# Altium schematic sheet Sensors.SchDoc: {Наименование}
size 209 x 297 mm; DocumentNumber: {Обозначение}; SheetNumber: {}; SheetTotal: {}; PageSetup: Record=PageOptions|CenterHorizontal=False|CenterVertical=False|PrintScale=0.99|XCorrection=0.00|YCorrection=0.00|PrintKind=2|BorderSize=5000000|LeftOffset=0|BottomOffset=0|Orientation=1|PaperLength=1000|PaperWidth=1000|Scale=100|PaperSource=15|PrintQuality=-3|MediaType=1|DitherType=10|PrintScaleMode=1|PaperKind=A4|PaperIndex=9; Rule: PcbType=ProtelPcb
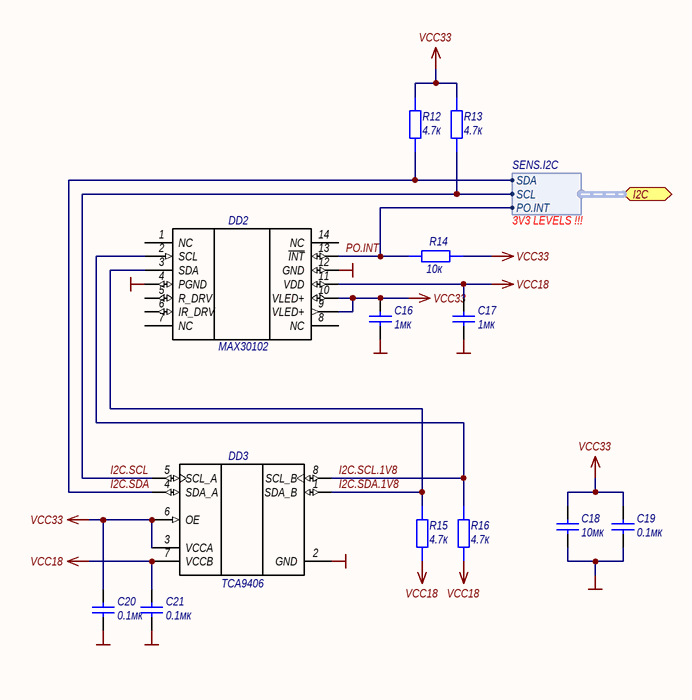
[diagram p0: Sensors.SchDoc]

## Parts
C16  value 1мк  [CAPC1005L]  (hidden comment: CL05A105KQ5NNN)
C17  value 1мк  [CAPC1005L]  (hidden comment: CL05A105KQ5NNN)
C18  value 10мк  [CAPC1005L]  (hidden comment: CL05A106MQ5NUN)
C19  value 0.1мк  [CAPC1005L]  (hidden comment: CL05A104KP5NNN)
C20  value 0.1мк  [CAPC1005L]  (hidden comment: CL05A104KP5NNN)
C21  value 0.1мк  [CAPC1005L]  (hidden comment: CL05A104KP5NNN)
DD2  MAX30102  [MAX30102]
DD3  TCA9406  [DCU8_L]
R12  value 4.7к  [RESC1005L]  (hidden comment: RC1005J472CS)
R13  value 4.7к  [RESC1005L]  (hidden comment: RC1005J472CS)
R14  value 10к  [RESC1005L]  (hidden comment: RC1005J103CS)
R15  value 4.7к  [RESC1005L]  (hidden comment: RC1005J472CS)
R16  value 4.7к  [RESC1005L]  (hidden comment: RC1005J472CS)

## Ports
I2C (harness SENS.I2C)

## Harnesses
SENS.I2C: SDA, SCL, PO.INT

## Nets
GND: C16.1 C17.1 C18.1 C19.1 C20.1 C21.1 DD2.4(PGND) DD2.12(GND) DD3.2(GND)
VCC18: C17.2 C21.2 DD2.11(VDD) DD3.7(VCCB) R15.1 R16.1
VCC33: C16.2 C18.2 C19.2 C20.2 DD2.9(VLED+) DD2.10(VLED+) DD3.3(VCCA) DD3.6(OE) R12.2 R13.2 R14.1
I2C.SCL: DD3.5(SCL_A) R13.1 ; port I2C.SCL
I2C.SCL.1V8: DD2.2(SCL) DD3.8(SCL_B) R16.2
I2C.SDA: DD3.4(SDA_A) R12.1 ; port I2C.SDA
I2C.SDA.1V8: DD2.3(SDA) DD3.1(SDA_B) R15.2
PO.INT: DD2.13(~{INT}) R14.2 ; port I2C.PO.INT

Not connected (* = marked no-connect by the designer): DD2 1(NC) 5(R_DRV) 6(IR_DRV) 7(NC) 8(NC) 14(NC)

## Notes on the sheet
- 3V3 LEVELS !!!
- Подп. и дата
- Инв. № дубл.
- Взам. инв. №
- Инв. № подл.
- Лист
- Изм.
- № докум.
- Подп.
- Дата

## Library data of the parts
C16 C17 = CL05A105KQ5NNN: Samsung MLCC Capacitor; Power/Voltage: 6.3В; Rem: SMD; Tolerance: ±10%; TU/GOST: EIA CC0402; ТКЕ/ТКС: X5R; VAL: 105; Manufacturer: Samsung; ManufacturerPartNumber: CL05A105KQ5NNN; PackageReference: 0402; Range: *; Part Number: CL05A105KQ5NNN; Pin Count: 2; Published: 01.05.2013; Publisher: Komiss Labs.
C18 = CL05A106MQ5NUN: Samsung MLCC Capacitor; Power/Voltage: 6.3В; Rem: SMD; Tolerance: ±20%; TU/GOST: EIA CC0402; ТКЕ/ТКС: X5R; VAL: 106; Manufacturer: Samsung; ManufacturerPartNumber: CL05A106MQ5NUN; PackageReference: 0402; Range: *; Part Number: CL05A106MQ5NUN; Pin Count: 2; Published: 01.05.2013; Publisher: Komiss Labs.
C19-C21 = CL05A104KP5NNN: Samsung MLCC Capacitor; Power/Voltage: 10В; Rem: SMD; Tolerance: ±10%; TU/GOST: EIA CC0402; ТКЕ/ТКС: X5R; VAL: 104; Manufacturer: Samsung; ManufacturerPartNumber: CL05A104KP5NNN; PackageReference: 0402; Range: *; Part Number: CL05A104KP5NNN; Pin Count: 2; Published: 01.05.2013; Publisher: Komiss Labs.
DD2 = MAX30102: High-Sensitivity Pulse Oximeter and  Heart-Rate Sensor for Wearable Health; Manufacturer: MAXIM Integrated; REM: SMD; ManufacturerPartNumber: MAX30102; PackageReference: LGA-14
DD3 = TCA9406: TCA9406 Dual Bidirectional 1-MHz I2C-BUS and SMBus Voltage Level-Translator, 1.65 to 3.6 V, -40 to 85 degC, 8-pin US8 (DCU), Green (RoHS & no Sb/Br); Manufacturer: Texas Instruments; REM: SMD; ManufacturerPartNumber: TCA9406; PackageReference: TSSOP-8
R12 R13 R15 R16 = RC1005J472CS: General Thick Film Chip Resistor; Manufacturer: Samsung; Power/Voltage: 0.063Вт; Tolerance: ±5%; Rem: SMD; Check: NO; TU/GOST: EIA RES0402; ТКЕ/ТКС: ±100ppm/°C; Designator: R?; F47: 4700,0; ManufacturerPartNumber: RC1005J472CS; PackageReference: 0402; Part Number: RC1005J472CS; Pin Count: 2; Published: 01.05.2013; Publisher: Komiss Labs.
R14 = RC1005J103CS: General Thick Film Chip Resistor; Manufacturer: Samsung; Power/Voltage: 0.063Вт; Tolerance: ±5%; Rem: SMD; Check: NO; TU/GOST: EIA RES0402; ТКЕ/ТКС: ±100ppm/°C; F47: 10000,0; ManufacturerPartNumber: RC1005J103CS; PackageReference: 0402; Part Number: RC1005J103CS; Pin Count: 2; Published: 01.05.2013; Publisher: Komiss Labs.